# EAGLE design ATTINY85_feeder (EAGLE 6.3)
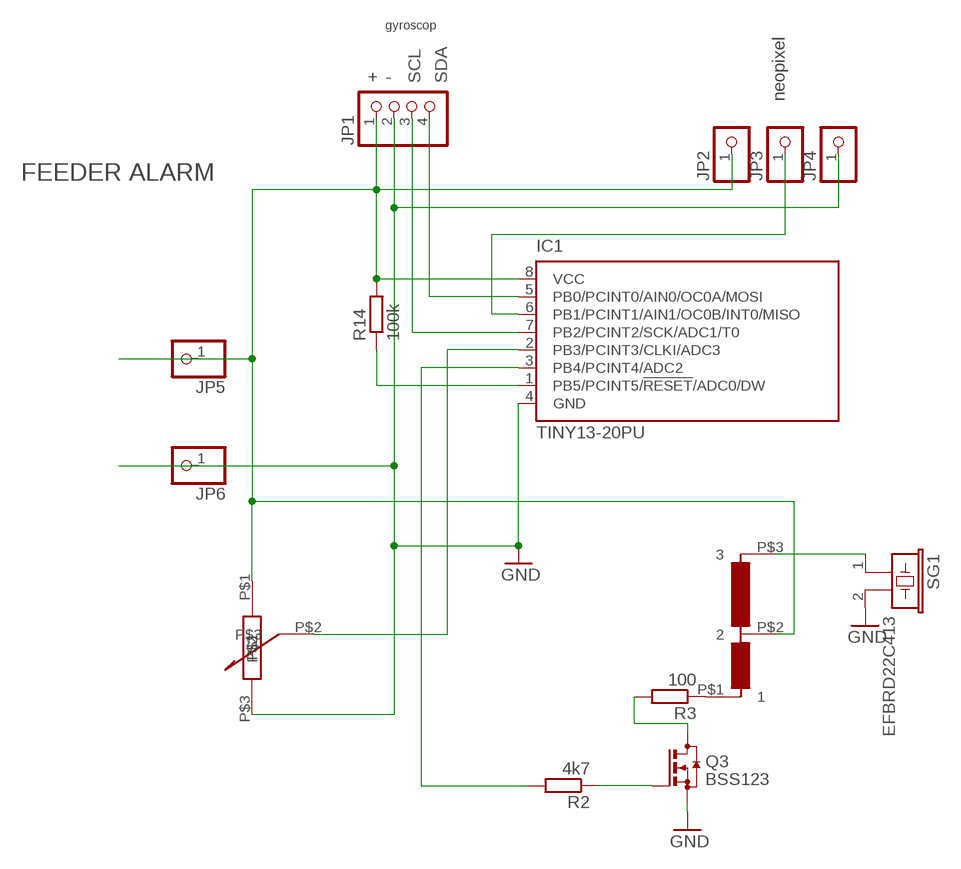
[diagram p0: schematic, sheet 1]

## Parts
IC1  TINY13-20PU  [DIL08]
JP1  PINHD-1X4  [1X04]
JP2  PINHD-1X1  [1X01]
JP3  PINHD-1X1  [1X01]
JP4  PINHD-1X1  [1X01]
JP5  PINHD-1X1  [1X01]
JP6  PINHD-1X1  [1X01]
Q3  BSS123  [SOT23]
R2  4k7  R-EU_0204/7  [0204/7]
R3  100  R-EU_0204/7  [0204/7]
R14  100k  R-EU_0204/7  [0204/7]
SG1  EFBRD22C413  [EFBRD22C413]
U$1  POTENCIOMETER  [POTENCIOMETER]
U$3  AUTOTRAFO  [AUTOTRAFO]

## Nets
GND: IC1.4(GND) JP1.2 JP4.1 JP6.1 Q3.2(S) SG1.2 U$1.P$3
N$2: IC1.3(PB4/PCINT4/ADC2) R2.2
N$3: IC1.6(PB1/PCINT1/AIN1/OC0B/INT0/MISO) JP3.1
N$4: IC1.7(PB2/PCINT2/SCK/ADC1/T0) JP1.3
N$5: IC1.2(PB3/PCINT3/CLKI/ADC3) U$1.P$2
N$6: IC1.5(PB0/PCINT0/AIN0/OC0A/MOSI) JP1.4
N$7: IC1.1(PB5/PCINT5/!RESET!/ADC0/DW) R14.1
N$8: R3.1 U$3.P$1
N$9: Q3.1(G) R2.1
N$10: SG1.1 U$3.P$3
N$11: Q3.3(D) R3.2
N$34: IC1.8(VCC) JP1.1 JP2.1 JP5.1 R14.2 U$1.P$1 U$3.P$2

## Notes on the sheet
- gyroscop
- + | - | SCL | SDA
- neopixel
- FEEDER ALARM

## Library data of the parts
IC1 = atmel:TINY13: 8-bit AVR Microcontroller with 1K Bytes In-System Programmable Flash Source: http://www.atmel.com/dyn/resources/prod_documents/2535S.pdf; MPN: ATTINY13-20PU; OC_FARNELL: 9171550; OC_NEWARK: 96K6521
JP1 = pinhead:PINHD-1X4: PIN HEADER
JP2-JP6 = pinhead:PINHD-1X1: PIN HEADER
Q3 = transistor-small-signal:BSS123: N-CHANNEL MOS FET
R2 R3 R14 = resistor:R-EU_: RESISTOR, European symbol
SG1 = buzzer:EFB?: Piezoelectric Acoustic Transducer Source: Panbasonic .. 2SC1685.pdf; OC_FARNELL: unknown; OC_NEWARK: unknown
U$1 = Moja_kniznica:POTENCIOMETER
U$3 = Moja_kniznica:AUTOTRAFO

## Board
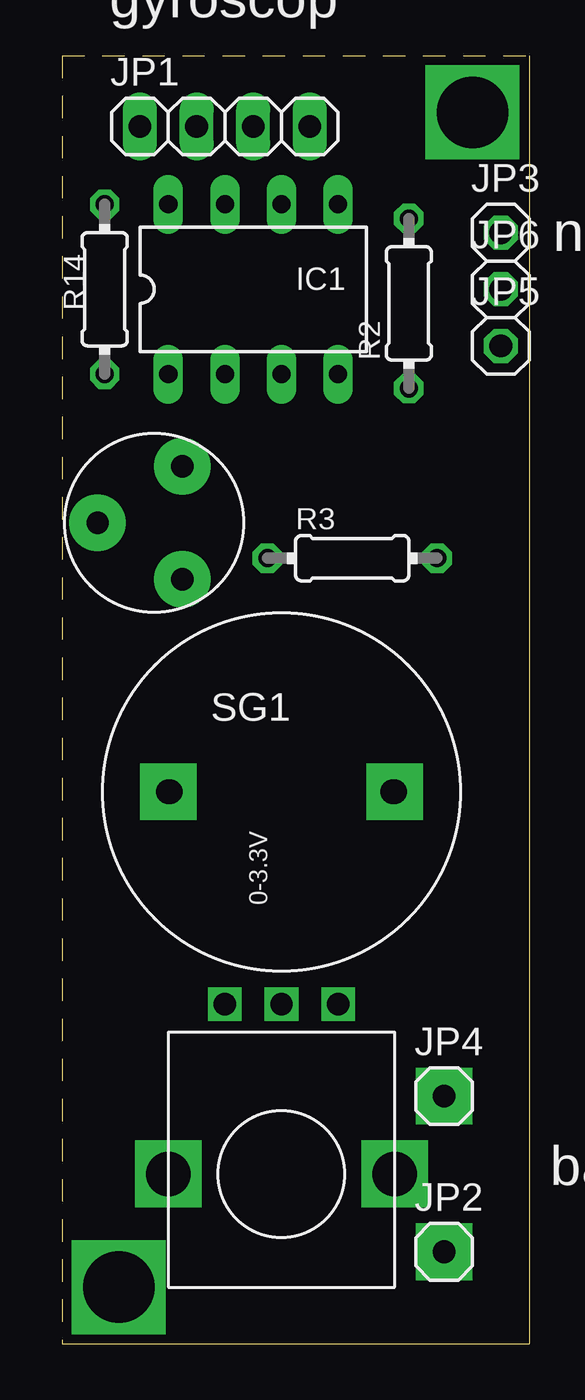
[diagram p1: board, top side]
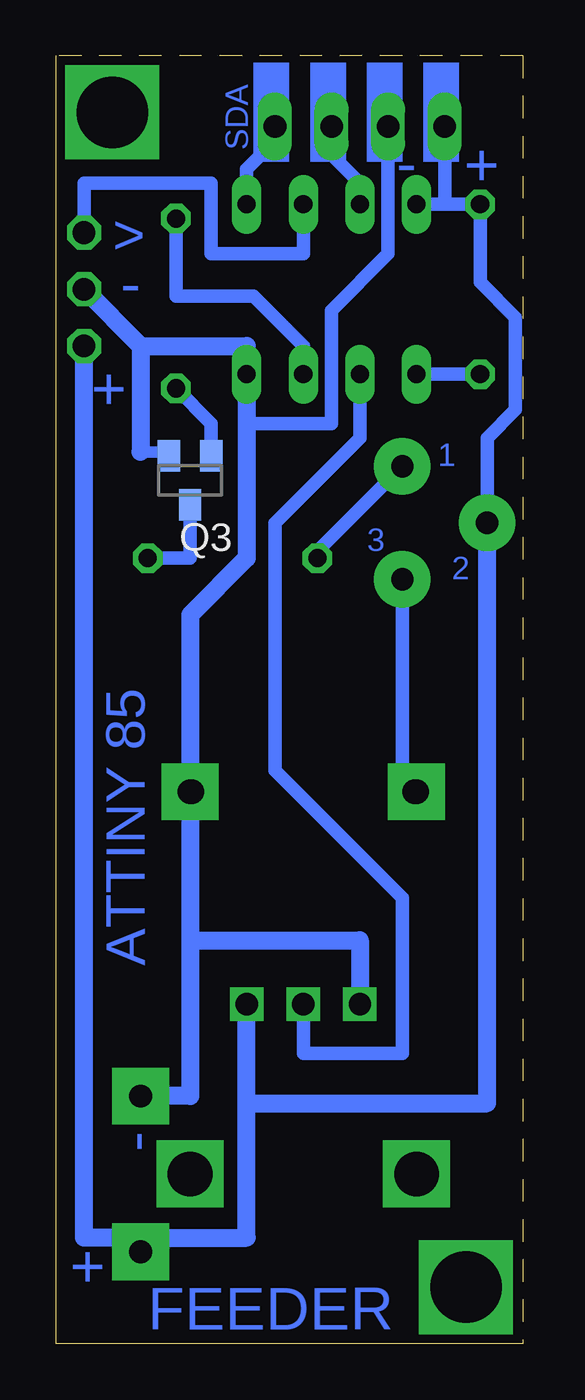
[diagram p2: board, bottom side, seen from below]

Size 20.95 x 57.78 mm. Coordinates in mm from the lower left corner, seen from the top.
Outline: 0,0 20.95,0 20.95,57.78 0,57.78 0,0
Copper layers (1*16): Top 0.035mm / dielectric 1.5mm / Bottom 0.035mm
Design rules "default *": minimum track width 20mil, minimum drill 24mil, track to track 8mil, track to pad 8mil, pad to pad 8mil, via to via 8mil, smd to smd 8mil, copper to edge 3mil, drill to drill 8mil, minimum pad ring 10mil, minimum via ring 8mil, stop-mask expansion 4mil, vias tented up to drill 0mil, thermal gap 10mil

### Footprints (pad centres in the part's own frame; a part is rotated, then mirrored left to right if it is on the bottom)
DIL08 = drill 0.813 long: 1 -3.81,-3.81; 2 -1.27,-3.81; 3 1.27,-3.81; 4 3.81,-3.81; 5 3.81,3.81; 6 1.27,3.81; 7 -1.27,3.81; 8 -3.81,3.81
1X04 = drill 1.016 long: 1 -3.81,0; 2 -1.27,0; 3 1.27,0; 4 3.81,0
1X01 = drill 1.016 octagon: 1 0,0
SOT23 = smd 1 x 1.4: 1 -0.95,-1.1; 2 0.95,-1.1; 3 0,1.1
0204/7 = drill 0.813 octagon: 1 -3.81,0; 2 3.81,0
EFBRD22C413 = drill 1.1 pad 1.676: 1 -5,0; 2 5,0
POTENCIOMETER = drill 1 square: P$1 2.54,-1.27; P$2 5.08,-1.27; P$3 7.62,-1.27 | drill 2 square: P$4 0,6.35; P$6 10.16,6.35
AUTOTRAFO = drill 1 pad 2.54: P$1 -1.27,-2.54; P$2 2.54,0; P$3 -1.27,2.54

### Placement (x,y rotation side)
IC1  8.57,47.31 0 top
JP1  7.3,54.61 0 top
JP2  17.14,4.13 0 top
JP3  19.68,49.85 0 top
JP4  17.14,11.11 0 top
JP5  19.68,44.77 0 top
JP6  19.68,47.31 0 top
Q3  14.92,38.73 180 bottom
R2  15.56,46.67 90 top
R3  13.02,35.24 0 top
R14  1.91,47.31 90 top
SG1  9.84,24.77 0 top
U$1  14.92,13.97 180 top
U$3  4.13,36.83 180 top

### Tracks (layer width: path | path; a pad name or v marks a point on that pad's centre or on a via)
GND  (via drill 1 pad 2.54, 1.1 pad 2.54)
  Bottom 0.508: 17.14,40.01 15.88,40.01 Q3.2 | v14.92,24.77 SG1.2
  Bottom 0.61: JP1.2 6.03,48.9 8.57,46.35 8.57,41.27 12.38,41.27
  Bottom 0.813: JP4.1 14.92,11.11 14.92,18.1 | 14.92,18.1 v14.92,24.77 14.92,32.7 12.38,35.24 12.38,41.27 IC1.4 12.38,44.77 17.14,44.77 | 17.14,44.77 17.14,40.01 | JP6.1 17.14,44.77 | 14.92,18.1 7.3,18.1 U$1.P$3
  other vias: 17.14,11.11
N$2
  Bottom 0.61: IC1.3 9.84,44.77 12.06,46.99 15.56,46.99 R2.2
N$3
  Bottom 0.61: IC1.6 9.84,48.9 13.97,48.9 13.97,52.07 19.68,52.07 JP3.1
N$4
  Bottom 0.508: 7.3,52.07 IC1.7 | JP1.3 8.57,53.34
  Bottom 0.61: 8.57,53.34 7.3,52.07
N$5
  Bottom 0.61: IC1.2 7.3,40.64 11.11,36.83 11.11,25.72 5.4,20 5.4,13.02 9.84,13.02 U$1.P$2
N$6
  Bottom 0.508: JP1.4 11.11,53.98
  Bottom 0.61: IC1.5 12.38,52.7 11.11,53.98
N$7
  Bottom 0.61: IC1.1 R14.1
N$8
  Bottom 0.61: U$3.P$1 9.21,35.56 R3.1
N$9
  Bottom 0.508: 13.97,40.01 Q3.1
  Bottom 0.61: 13.97,40.01 13.97,41.27 R2.1
N$10
  Bottom 0.508: 5.4,25.4 SG1.1
  Bottom 0.61: U$3.P$3 5.4,25.4
N$11
  Bottom 0.61: Q3.3 14.92,35.24 R3.2
N$12  (via drill 0.8 pad 2.54)
  other vias: 17.14,4.13
N$13  (via drill 1.1 pad 2.54)
  other vias: 4.76,24.77
N$21  (via drill 3.2)
  other vias: 2.54,2.54
N$23  (via drill 3.2 pad 1.93)
  other vias: 18.41,55.24
N$34
  Bottom 0.61: IC1.8 3.49,51.12 | 3.49,51.12 R14.2 1.91,47.62 0.32,46.04 0.32,41.91 1.59,40.64 U$3.P$2 | 3.49,51.12 JP1.1
  Bottom 0.813: 17.14,4.76 12.38,4.76 12.38,10.79 | 12.38,10.79 U$1.P$1 | JP5.1 19.68,4.76 17.14,4.76 | JP2.1 17.14,4.76 | U$3.P$2 1.59,10.79 12.38,10.79
(copper drawn outside any net)
  shapes: Bottom area x4

### Text on the board
Bottom: SDA | + | - | - | > | + | 1 | 3 | 2 | ATTINY 85 | - | + | FEEDER
tPlace: gyroscop | neopixel | bat
tNames: 0-3.3V